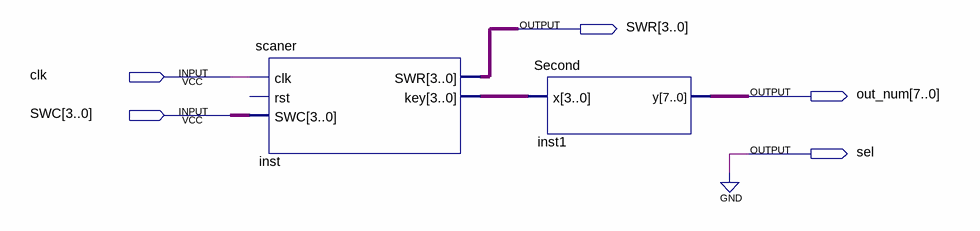
[diagram p0: schematic sheet]
// Quartus schematic Eleventh.bdf as structural Verilog: 2 symbols, 5 pins
module Eleventh (
  input  clk,
  input  [3:0] SWC,
  output [3:0] SWR,
  output [7:0] out_num,
  output sel
);

  wire [3:0] inst_key;

  scaner inst (.clk(clk), .SWC(SWC), .SWR(SWR), .key(inst_key));  // open: rst
  Second inst1 (.x(inst_key), .y(out_num));

  assign sel = 1'b0;
endmodule
